# Altium project Board4.PrjPcb
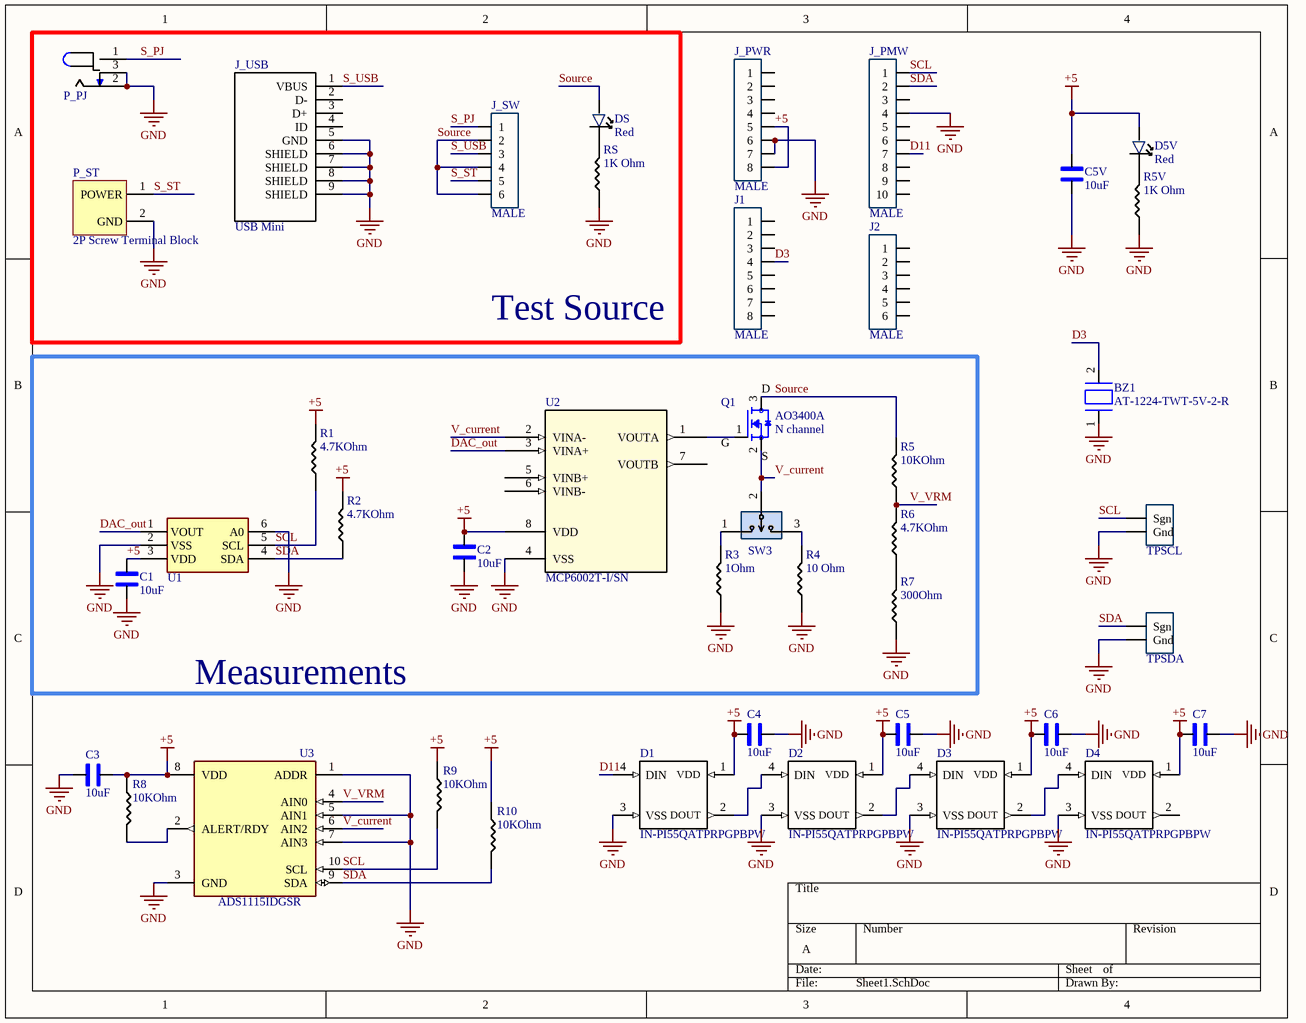
[diagram p0: Sheet1.SchDoc]
1 sheet, 42 parts. Net scope: global (net labels, ports and power ports of the same name join across sheets).
Board file: PCB1.PcbDoc

## Sheet Sheet1.SchDoc
size A; SheetNumber: 1; SheetTotal: 1

### Parts
BZ1  AT-1224-TWT-5V-2-R  [BUZZER- TH]
C1  10uF  [1206_Passive_Capacitor]
C2  10uF  [1206_Passive_Capacitor]
C3  10uF  [1206_Passive_Capacitor]
C4  10uF  [1206_Passive_Capacitor]
C5  10uF  [1206_Passive_Capacitor]
C5V  10uF  [1206_Passive_Capacitor]
C6  10uF  [1206_Passive_Capacitor]
C7  10uF  [1206_Passive_Capacitor]
D1  IN-PI55QATPRPGPBPW  [SERIAL_LED - duplicate]
D2  IN-PI55QATPRPGPBPW  [SERIAL_LED - duplicate]
D3  IN-PI55QATPRPGPBPW  [SERIAL_LED - duplicate]
D4  IN-PI55QATPRPGPBPW  [SERIAL_LED - duplicate]
D5V  Red  [LED_1206]
DS  Red  [LED_1206]
J1  value MALE  [8_PIN_100MIL-Male]  (hidden comment: MALE 8PIN)
J2  MALE  [6_PIN_100MIL-Male]
J_PMW  value MALE  [10_PIN_100MIL-Male]  (hidden comment: MALE 10PIN)
J_PWR  value MALE  [8_PIN_100MIL-Male]  (hidden comment: MALE 8PIN)
J_SW  MALE  [6_PIN_100MIL-Male]
J_USB  USB Mini  [USB_MINI_B]
P_PJ  Power Jack  [Power_Jack]  (value not drawn)
P_ST  2P Screw Terminal Block  [P_Terminal block 3.5mm-pitch]
Q1  AO3400A  value N channel  [N-MOSFET]
R1  4.7KOhm  [1206_Passive_Resitor]
R2  4.7KOhm  [1206_Passive_Resitor]
R3  value 1Ohm  [1206_Passive_Resitor]  (hidden comment: 1 Ohm)
R4  10 Ohm  [1206_Passive_Resitor]
R5  value 10KOhm  [1206_Passive_Resitor]  (hidden comment: 10k)
R5V  value 1K Ohm  [1206_Passive_Resitor]  (hidden comment: 1k)
R6  4.7KOhm  [1206_Passive_Resitor]
R7  value 300Ohm  [1206_Passive_Resitor]  (hidden comment: 300 Ohm)
R8  value 10KOhm  [1206_Passive_Resitor]  (hidden comment: 10k)
R9  value 10KOhm  [1206_Passive_Resitor]  (hidden comment: 10k)
R10  value 10KOhm  [1206_Passive_Resitor]  (hidden comment: 10k)
RS  value 1K Ohm  [1206_Passive_Resitor]  (hidden comment: 1k)
SW3  PREC003SAAN-RC  [3_PIN_100mil]  (value not drawn)
TPSCL  10x Probe TP  [TP10x_Probe]  (value not drawn)
TPSDA  10x Probe TP  [TP10x_Probe]  (value not drawn)
U1  DAC IC  [MCP4725]  (value not drawn)
U2  MCP6002T-I/SN  [SOIC127P600X175-8N]
U3  ADS1115IDGSR  [ADC_ADS1115IDGSR]

### Blocks framed on the sheet
Test Source: DS J_SW J_USB P_PJ P_ST RS
Measurements: C1 C2 Q1 R1-R7 SW3 U1 U2

### Nets
+5: C1.2 C2.2 C3.2 C4.1 C5.1 C5V.2 C6.1 C7.1 D1.1(VDD) D2.1(VDD) D3.1(VDD) D4.1(VDD) D5V.1 J_PWR.5 J_PWR.8 R1.2 R2.2 R8.2 R9.2 R10.2 U1.3(VDD) U2.8(VDD) U3.8(VDD)
GND: BZ1.1(BZ1) C1.1 C2.1 C3.1 C4.2 C5.2 C5V.1 C6.2 C7.2 D1.3(VSS) D2.3(VSS) D3.3(VSS) D4.3(VSS) J_PMW.4 J_PWR.6 J_PWR.7 J_USB.5(GND) J_USB.6(SHIELD) J_USB.7(SHIELD) J_USB.8(SHIELD) J_USB.9(SHIELD) P_PJ.2 P_PJ.3 P_ST.2(GND) R3.1 R4.1 R5V.1 R7.1 RS.1 TPSCL.2(Gnd) TPSDA.2(Gnd) U1.2(VSS) U1.6(A0) U2.4(VSS) U3.1(ADDR) U3.3(GND) U3.5(AIN1) U3.7(AIN3)
D3: BZ1.2(BZ2) J1.4
D11: D1.4(DIN) J_PMW.7
DAC_out: U1.1(VOUT) U2.3(VINA+)
S_PJ: J_SW.1 P_PJ.1
S_ST: J_SW.5 P_ST.1(POWER)
S_USB: J_SW.3 J_USB.1(VBUS)
SCL: J_PMW.1 R1.1 R9.1 TPSCL.1(Sgn) U1.5(SCL) U3.10(SCL)
SDA: J_PMW.2 R2.1 R10.1 TPSDA.1(Sgn) U1.4(SDA) U3.9(SDA)
Source: DS.1 J_SW.2 J_SW.4 J_SW.6 Q1.3(D) R5.2
V_current: Q1.2(S) SW3.2 U2.2(VINA-) U3.6(AIN2)
V_VRM: R5.1 R6.2 U3.4(AIN0)
NetD1_2: D1.2(DOUT) D2.4(DIN)
NetD2_2: D2.2(DOUT) D3.4(DIN)
NetD3_2: D3.2(DOUT) D4.4(DIN)
NetD5V_2: D5V.2 R5V.2
NetDS_2: DS.2 RS.2
NetQ1_1: Q1.1(G) U2.1(VOUTA)
NetR3_2: R3.2 SW3.1
NetR4_2: R4.2 SW3.3
NetR6_1: R6.1 R7.2
NetR8_1: R8.1 U3.2(ALERT/RDY)

Not connected (* = marked no-connect by the designer): D4 2(DOUT); J1 1 2 3 5 6 7 8; J2 1 2 3 4 5 6; J_PMW 3 5 6 8 9 10; J_PWR 1 2 3 4; J_USB 2(D-) 3(D+) 4(ID); U2 5(VINB+) 6(VINB-) 7(VOUTB)

### Library data of the parts
BZ1 = BUZZER_1: Buzzers Transducer, Externally Driven Electromechanical/Magnetic 5 V 40mA 2.4kHz 87dB @ 5V, 10cm Through Hole PC Pins; Datasheet: https://www.puiaudio.com/media/SpecSheet/AT-1224-TWT-5V-2-R.pdf; MFR Part #: AT-1224-TWT-5V-2-R
C1-C5 C5V C6 C7 = C_10uF_1206: 10uF ±10% 50V X5R 1206 Multilayer Ceramic Capacitors MLCC - SMD/SMT RoHS; MFR Part #: CL31A106KBHNNNE; Type: Basic; LCSC Part#: C13585; Datasheet: https://datasheet.lcsc.com/lcsc/1810221112_Samsung-Electro-Mechanics-CL31A106KBHNNNE_C13585.pdf; Value: 10uF
D1-D4 = LED_Smart: LIGHT EMITTING DIODES (LED) RGB 620~630NM RED, 520~530NM GREEN, 465~475NM BLUE 600MCD@16MARED,1200MCD@16MAGREEN,300MCD@16MABLUE TOP VIEW SMD-4 ROHS; MFR Part #: XL-5050RGBC-WS2812B; Manufacturer: XINGLIGHT; LCSC Part#: C2843785; DataSheet: https://datasheet.lcsc.com/lcsc/2301111130_XINGLIGHT-XL-5050RGBC-WS2812B_C2843785.pdf
D5V = LED_RED_1206: Red 621~631nm 1206 Light Emitting Diodes (LED) RoHS; MFR Part #: 15-21/R6C-FQ1R1B/2T; Type: Extended; LCSC Part#: C93133; Datasheet: https://datasheet.lcsc.com/szlcsc/1811151241_Everlight-Elec-15-21-R6C-FQ1R1B-2T_C93133.pdf; Value: Red
DS = LED_RED_1206: Red 621~631nm 1206 Light Emitting Diodes (LED) RoHS; MFR Part #: 15-21/R6C-FQ1R1B/2T; LCSC Part#: C93133; Type: Extended; Datasheet: https://datasheet.lcsc.com/szlcsc/1811151241_Everlight-Elec-15-21-R6C-FQ1R1B-2T_C93133.pdf; Value: Red
J1 J_PWR = JM_8_PIN_MALE: Pin Header 8 1 right-angle，180degrees 2.54mm Through Hole,P=2.54mm Pin Header & Female Header RoHS; LCSC Part#: C492407; Datasheet: https://datasheet.lcsc.com/szlcsc/2003191006_XFCN-PZ254V-11-08P_C492407.pdf; Type: Extended
J2 J_SW = JM_6_PIN_MALE: Male header- 6 pin 1 row- through Hole; LCSC Part#: C37208; Datasheet: https://datasheet.lcsc.com/szlcsc/1810312320_BOOMELE-Boom-Precision-Elec-C37208_C37208.pdf; Type: Extended; Value: MALE
J_PMW = JM_10_PIN_MALE: Pin Header 10 1 Straight ，180degrees 2.54mm Through Hole,P=2.54mm Pin Header & Female Header RoHS; LCSC Part#: C124372; Type: Extended; Datasheet: https://datasheet.lcsc.com/szlcsc/1810241611_Ckmtw-Shenzhen-Cankemeng-C124372_C124372.pdf
J_USB = J_USB_B_Mini: Through Hole USB Connectors RoHS; MFR Part #: 920-462A2021D10102; Value: USB mini B; LCSC Part#: C46398; Datasheet: https://datasheet.lcsc.com/szlcsc/2103081233_Jing-Extension-of-the-Electronic-Co-920-462A2021D10102_C46398.pdf; Type: Extended
P_PJ = P_Power Jack: Power Barrel Connector Jack 2.10mm ID (0.083"), 5.50mm OD (0.217") Through Hole, Right Angle; MFR Part #: PJ-102A; Value: CONN PWR JACK 2X5.5MM SOLDER; Digikey Link: https://www.digikey.com/product-detail/en/PJ-102A/CP-102A-ND/275425/?itemSeq=304982367; LCSC Part#: C136744; Type: Extended
P_ST = P_Terminal block: Green Straight pin 3.5mm  pitch; P=3.5mm  Screw terminal ROHS; MFR Part #: KF350-3.5-2P; Manufacturer: Cixi Kefa Elec; LCSC Part#: C474892; DataSheet: https://datasheet.lcsc.com/lcsc/2001160007_Cixi-Kefa-Elec-KF350-3-5-2P_C474892.pdf
Q1 = Q_Nch_MOSFET: MOSFET N Trench 30V 5.7A 1.5V @ 250uA 26.5 m? @ 5.7A,10V SOT-23-3L RoHS; Type: Basic; LCSC Part#: C20917; Datasheet: https://datasheet.lcsc.com/szlcsc/Alpha-Omega-Semicon-AOS-AO3400A_C20917.pdf; MFR Part #: AO3400A
R1 R2 R6 = R_4.7k_1206: 4.7kΩ ±1% 0.25W ±100ppm/℃ 1206 Chip Resistor - Surface Mount RoHS; MFR Part #: 1206W4F4701T5E; LCSC Part#: C17936; Datasheet: https://datasheet.lcsc.com/lcsc/1810301414_UNI-ROYAL-Uniroyal-Elec-1206W4F4701T5E_C17936.pdf; Type: Basic; Value: 4.7KOhm
R3 = R_1Ohm_1206: 1Ω ±5% 0.25W ±400ppm/℃ 1206 Chip Resistor - Surface Mount RoHS; MFR Part #: 1206W4J010JT5E; LCSC Part#: C1409; Datasheet: https://datasheet.lcsc.com/lcsc/1810301410_UNI-ROYAL-Uniroyal-Elec-1206W4J010JT5E_C1409.pdf; Type: Extended
R4 = R_10Ohm_1206: CHIP RESISTOR - SURFACE MOUNT 0.1OHMS ±1% 1/4W 1206 ROHS; MFR Part #: 1206W4F100JT5E; Datasheet: https://datasheet.lcsc.com/szlcsc/Uniroyal-Elec-1206W4F100JT5E_C17903.pdf; LCSC Part#: C17903; Type: Basic; Value: 10 Ohm
R5 R8-R10 = R_10KOhm_1206: 10 kOhms ±5% 0.25W, 1/4W Chip Resistor 1206 (3216 Metric) Automotive AEC-Q200 Thick Film; MFR Part #: RMCF1206FT10K0; Digikey Link: https://www.digikey.com/en/products/detail/stackpole-electronics-inc/RMCF1206FT10K0/1759669; LCSC Part#: C17902; Type: Basic
R5V RS = R_1K_1206: CHIP RESISTOR - SURFACE MOUNT 1KOHMS ±1% 1/4W 1206 ROHS; MFR Part #: RNCP1206FTD1K00CT; Digikey Link: https://www.digikey.com/product-detail/en/RNCP1206FTD1K00/RNCP1206FTD1K00CT-ND/2240675/?itemSeq=304982373; LCSC Part#: C4410; Type: Basic
R7 = R_300Ohm_1206: CHIP RESISTOR - SURFACE MOUNT 300OHMS ±1% 1/4W 1206 ROHS; MFR Part #: 1206W4F3000T5E; Datasheet: https://datasheet.lcsc.com/szlcsc/Uniroyal-Elec-1206W4F3000T5E_C17887.pdf; LCSC Part#: C17887; Type: Basic
SW3 = SW_3Pin_100mil_Switch: Connector Header Through Hole 3 position 0.100" (2.54mm); Value: CONN HEADER VERT 3POS 2.54MM; Digikey Link: https://www.digikey.com/product-detail/en/PREC003SAAN-RC/S1012EC-03-ND/2774851/?itemSeq=304982371; MFR Part #: PREC003SAAN-RC; Type: Extended; LCSC Part#: C49257
TPSCL TPSDA = TP_10x_Probe: Test Point 300 mil centers
U1 = U_MCP4725A0T-E/CH: IC DAC 12BIT V-OUT SOT23-6; Datasheet: https://ww1.microchip.com/downloads/en/DeviceDoc/22039d.pdf; LCSC Part#: C144198; type: Extended; MFR Part #: MCP4725A0T-E/CH
U2 = U_MCP6002T-I/SN: 0.6 V/us 2 1MHz 1.8V ~ 6V 100μA General Purpose SOIC-8_150mil  Operational Amplifier ROHS; Mfr: Microchip; MFR Part #: MCP6002T-I/SN; DataSheet: https://ww1.microchip.com/downloads/en/DeviceDoc/MCP6001-1R-1U-2-4-1-MHz-Low-Power-Op-Amp-DS20001733L.pdf; LCSC Part#: C7377; Type: Basic
U3 = U_ADC_ADS1115IDGSR: 16-Bit ADC with Integrated MUX, PGA, Comparator, Oscillator, and Reference 10-VSSOP -40 to 125; MFR Part #: ADS1115IDGSR; Package: MSOP-10 Texas Instruments; LCSC Part#: C37593; SnapEDA_Link: https://www.snapeda.com/parts/ADS1115IDGSR/Texas%20Instruments/view-part/?ref=snap; Type: Extended; DigiKey link: https://www.digikey.com/product-detail/en/texas-instruments/ADS1115IDGSR/296-38849-1-ND/5142969?utm_source=snapeda&utm_medium=aggregator&utm_campaign=symbol; Value: *